# Altium schematic sheet CAN Expansion V1.SchDoc
size A4; SheetNumber: 1; SheetTotal: 1
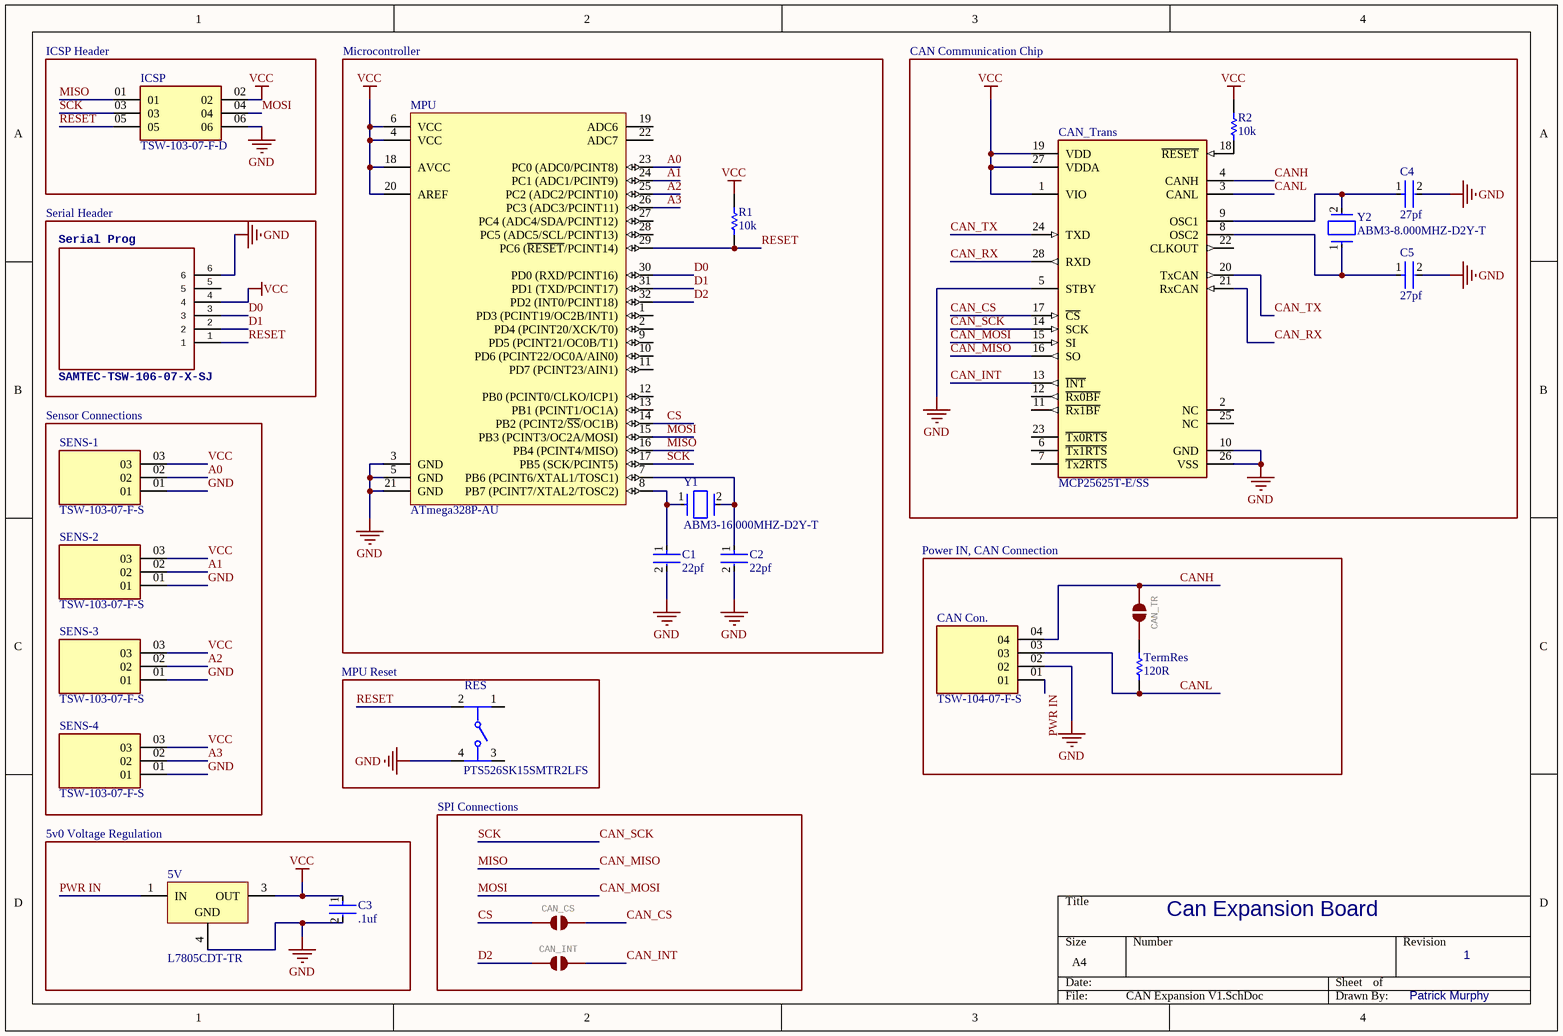
[diagram p0: CAN Expansion V1.SchDoc]

## Parts
5V  L7805CDT-TR  [TO-252_N]
C1  22pf  [FP-GRM21B-0_15-IPC_C]
C2  22pf  [FP-GRM21B-0_15-IPC_C]
C3  .1uf  [FP-GRM21B-0_15-IPC_C]
C4  27pf  [FP-GRM21B-0_15-IPC_C]
C5  27pf  [FP-GRM21B-0_15-IPC_C]
CAN_Con.  TSW-104-07-F-S  [SAMTEC_TSW-104-07-F-S]
CAN_CS  (no value)  [SMT-JUMPER_2_NO_SILK]
CAN_INT  (no value)  [SMT-JUMPER_2_NO_SILK]
CAN_TR  (no value)  [SMT-JUMPER_2_NO_SILK]
CAN_Trans  MCP25625T-E/SS  [FP-C04-073-IPC_B]
ICSP  TSW-103-07-F-D  [SAMTEC_TSW-103-07-F-D]
MPU  ATmega328P-AU  [32A_M]
R1  10k  [RESC2013X60X40LL20T25]
R2  10k  [RESC2013X60X40LL20T25]
RES  PTS526SK15SMTR2LFS  [FP-PTS526SK15SMTR2LFS-MFG]
SENS-1  TSW-103-07-F-S  [SAMTEC_TSW-103-07-F-S]
SENS-2  TSW-103-07-F-S  [SAMTEC_TSW-103-07-F-S]
SENS-3  TSW-103-07-F-S  [SAMTEC_TSW-103-07-F-S]
SENS-4  TSW-103-07-F-S  [SAMTEC_TSW-103-07-F-S]
Serial_Prog  SAMTEC-TSW-106-07-X-SJ  [SAMTEC-TSW-106-07-X-S]
TermRes  120R  [RESC2013X60X40LL20T25]
Y1  ABM3-16.000MHZ-D2Y-T  [FP-ABM3-MFG]
Y2  ABM3-8.000MHZ-D2Y-T  [FP-ABM3-MFG]

## Blocks framed on the sheet
ICSP Header: ICSP
Microcontroller: C1 C2 MPU R1 Y1
CAN Communication Chip: C4 C5 CAN_Trans R2 Y2
Serial Header: Serial_Prog
Sensor Connections: SENS-1-SENS-4
Power IN, CAN Connection: CAN_Con. CAN_TR TermRes
MPU Reset: RES
5v0 Voltage Regulation: 5V C3
SPI Connections: CAN_CS CAN_INT

## Nets
GND: 5V.4(GND) C1.2 C2.2 C3.2 C4.2 C5.2 CAN_Con..02 CAN_Trans.5(STBY) CAN_Trans.10(GND) CAN_Trans.26(VSS) ICSP.06 MPU.3(GND) MPU.5(GND) MPU.21(GND) RES.4 SENS-1.01 SENS-2.01 SENS-3.01 SENS-4.01 Serial_Prog.6
VCC: 5V.3(OUT) C3.1 CAN_Trans.1(VIO) CAN_Trans.19(VDD) CAN_Trans.27(VDDA) ICSP.02 MPU.4(VCC) MPU.6(VCC) MPU.18(AVCC) MPU.20(AREF) R1.2 R2.2 SENS-1.03 SENS-2.03 SENS-3.03 SENS-4.03 Serial_Prog.4
A0: MPU.23(PC0_(ADC0/PCINT8)) SENS-1.02
A1: MPU.24(PC1_(ADC1/PCINT9)) SENS-2.02
A2: MPU.25(PC2_(ADC2/PCINT10)) SENS-3.02
A3: MPU.26(PC3_(ADC3/PCINT11)) SENS-4.02
CAN_CS: CAN_CS.2 CAN_Trans.17(~{CS})
CAN_INT: CAN_INT.2 CAN_Trans.13(~{INT})
CAN_MISO: CAN_Trans.16(SO) ICSP.01 MPU.16(PB4_(PCINT4/MISO))  [also labelled MISO]
CAN_MOSI: CAN_Trans.15(SI) ICSP.04 MPU.15(PB3_(PCINT3/OC2A/MOSI))  [also labelled MOSI]
CAN_RX: CAN_Trans.21(RxCAN) CAN_Trans.28(RXD)
CAN_SCK: CAN_Trans.14(SCK) ICSP.03 MPU.17(PB5_(SCK/PCINT5))  [also labelled SCK]
CAN_TX: CAN_Trans.20(TxCAN) CAN_Trans.24(TXD)
CANH: CAN_Con..04 CAN_TR.1 CAN_Trans.4(CANH)
CANL: CAN_Con..03 CAN_Trans.3(CANL) TermRes.1
CS: CAN_CS.1 MPU.14(PB2_(PCINT2/~{SS}/OC1B))
D0: MPU.30(PD0_(RXD/PCINT16)) Serial_Prog.3
D1: MPU.31(PD1_(TXD/PCINT17)) Serial_Prog.2
D2: CAN_INT.1 MPU.32(PD2_(INT0/PCINT18))
PWR IN: 5V.1(IN) CAN_Con..01
RESET: ICSP.05 MPU.29(PC6_(~{RESET}/PCINT14)) R1.1 RES.2 Serial_Prog.1
NetC1_1: C1.1 MPU.8(PB7_(PCINT7/XTAL2/TOSC2)) Y1.1
NetC2_1: C2.1 MPU.7(PB6_(PCINT6/XTAL1/TOSC1)) Y1.2
NetC4_1: C4.1 CAN_Trans.9(OSC1) Y2.2
NetC5_1: C5.1 CAN_Trans.8(OSC2) Y2.1
NetCAN_TR_2: CAN_TR.2 TermRes.2
NetCAN_Trans_18: CAN_Trans.18(~{RESET}) R2.1

Not connected (* = marked no-connect by the designer): CAN_Trans 2(NC) 6(~{Tx1RTS}) 7(~{Tx2RTS}) 11(~{Rx1BF}) 12(~{Rx0BF}) 22(CLKOUT) 23(~{Tx0RTS}) 25(NC); MPU 1(PD3_(PCINT19/OC2B/INT1)) 2(PD4_(PCINT20/XCK/T0)) 9(PD5_(PCINT21/OC0B/T1)) 10(PD6_(PCINT22/OC0A/AIN0)) 11(PD7_(PCINT23/AIN1)) 12(PB0_(PCINT0/CLKO/ICP1)) 13(PB1_(PCINT1/OC1A)) 19(ADC6) 22(ADC7) 27(PC4_(ADC4/SDA/PCINT12)) 28(PC5_(ADC5/SCL/PCINT13)); RES 1 3; Serial_Prog 5

## Notes on the sheet
- Can Expansion Board
- 1
- Patrick Murphy

## Library data of the parts
5V = CMP-0244-00216-1: Positive Voltage Regulator, 3-Pin DPAK, Tape and Reel; PackageVersion: 2011; PackageReference: TO-252; DatasheetVersion: 16/11/2011; PackageDescription: 3-Pin Transistor Outline Package 2.28 mm Pitch, 9.7 mm Lead Span (DPAK); ComponentLink1URL: http://www.st.com; ComponentLink2Description: Datasheet; ComponentLink1Description: Manufacturer URL; ComponentLink2URL: http://www.st.com/internet/com/TECHNICAL_RESOURCES/TECHNICAL_LITERATURE/DATASHEET/CD00000444.pdf
C1-C5 = CMP-2007-03541-2: Chip Multilayer Ceramic Capacitors for General Purpose, 0805, 10uF, X5R, 15%, 10%, 25V; Length: 2mm; Depth: 1.25mm; Termination: SMD/SMT; Voltage: 25V; Height: 1.25mm; Material: Ceramic; Thickness: 0.053inch; Radiation Hardening: No; Min Operating Temperature: -55°C; Width: 0.049inch; Package Quantity: 1; Mount: Surface Mount; Dielectric: X5R; Packaging: Tape and Reel; Capacitance: 10uF; Voltage Rating (DC): 25V; Lead Free: Lead Free; Max Operating Temperature: 85°C; Case Code (Imperial): 0805; Case/Package: 0805; Tolerance: 10%; Voltage Rating: 25V; Case Code (Metric): 2012
CAN_Con. = TSW-104-07-F-S: MF: Samtec; MP: TSW-104-07-F-S; Price: None; Package: None; Availability: Unavailable; Value: *
CAN_CS CAN_INT CAN_TR = JUMPER-SMT_2_NO_SILK: GateName_1: G$1; SymbolName_1: SMT-JUMPER_2_NO; DeviceName: _SILK; LibraryName: SparkFun-Jumpers; DeviceSetName: JUMPER-SMT_2_NO; Package: SMT-JUMPER_2_NO_SILK
CAN_Trans = CMP-06279-000016-1: IC TRANSCEIVER 1/1 28SSOP; Max Supply Voltage: 5.5V; Number of Receivers: 1; Receiver Hysteresis: 200mV; Data Rate: 1Mbps; Min Supply Voltage: 4.5V; Propagation Delay: 125ns; Operating Supply Current: 70mA; Interface: SPI; Case/Package: SSOP; Max Operating Temperature: 125°C; Weight: 0.080001oz; Mount: Surface Mount; RoHS Compliant: Yes; Package Quantity: 2100; Packaging: Tape and Reel; Min Operating Temperature: -40°C; Number of Pins: 28; Number of Drivers: 1; Number of Transceivers: 1
ICSP = TSW-103-07-F-D: MF: Samtec; Package: None; Availability: Unavailable; Value: *; MP: TSW-103-07-F-D; Price: None
MPU = CMP-0095-00269-2: 8-bit AVR Microcontroller, 32KB Flash, 1KB EEPROM, 2KB SRAM, 32-pin TQFP, Industrial Grade (-40°C to 85°C); PackageDescription: 32-Lead, 7x7x1.0 mm Body, 0.8mm Lead Pitch, Thin Profile Plastic Quad Flat Package (TQFP); DatasheetVersion: revD, May-2011; RevisionNote: DatasheetVersion & PackageVersion updated. URLs added.; ComponentLink1URL: http://www.atmel.com/; ComponentLink2Description: ATmega48A/48PA/88A/88PA/168A/168PA/328/328P Datasheet; Code_JEDEC: MS-026-ABA; ComponentLink1Description: Manufacturer URL; PackageReference: 32A; ComponentLink3Description: ATmega48A/48PA/88A/88PA/168A/168PA/328/328P Summary; ComponentLink2URL: http://www.atmel.com/dyn/resources/prod_documents/doc8271.pdf; PackageVersion: revC, Oct-2010; ComponentLink3URL: http://www.atmel.com/dyn/resources/prod_documents/8271S.pdf
R1 R2 TermRes = CMP-2001-00645-1: Part Number: ERA6AEB473V; Manufacturer: Panasonic
RES = CMP-10040-000013-1: TACT 5.2 X 5.2, 1.5 MM H, 260GF,; Manufacturer: C&K; Operating Force: 250gf; Throw Configuration: SPST-NO; Contact Current Rating: 50mA; Standoff Height: 0mm; Contact Resistance: 100mΩ; Voltage Rating Dc: 12V; Electromechanical Life: 200000Cycles; Device Class L3: Tactile Switches; Device Class L2: Switches; Temperature: -20°C to +70°C; Temperature Range Low: -20°C; Package: PTS526SK15SMTR2LFS; Temperature Range High: +70°C; ComponentLink2Description: Datasheet; Device Class L1: Electromechanical; Height: 1.65mm; Digikey Description: TACT 5.2 X 5.2, 1.5 MM H, 260GF,; Category: Switch; RoHS: TRUE; Automotive: No; Lead Free: Yes; Manufacturer Part Number: PTS526SK15SMTR2LFS; Octopart: https://octopart.com/pts526+sk15+smtr2+lfs-c%26k+components-100617999; ComponentLink2URL: https://www.ckswitches.com/media/2780/pts526.pdf
SENS-1-SENS-4 = TSW-103-07-F-S: MF: Samtec; Package: None; Price: None; MP: TSW-103-07-F-S; Availability: Unavailable; Value: *
Y1 = CMP-27762-004490-1: Crystal 16MHz ±20ppm 18pF SMD-2 5mm x 3.2mm; Frequency Stability: 30ppm; Series Resistance: 40R; Tolerance: 20ppm; Frequency Tolerance: 20ppm; Load Capacitance: 18pF; Resistor Type: Ceramic; Termination: SMD/SMT; Width: 0.126inch; Mount: Surface Mount; RoHS Compliant: Yes; Package Quantity: 1000; Height: 0.051inch; Length: 0.197inch; Frequency: 16MHz; Operating Frequency: 16 MHz; Packaging: Tape and Reel; Max Operating Temperature: 85°C; Series: ABM3; Case/Package: SMD/SMT; Lead Free: Lead Free; ESR (Equivalent Series Resistance): 40R; Number of Pins: 2; Min Operating Temperature: -40°C
Y2 = CMP-2000-05033-2: Crystal 8MHz ±20ppm 18pF SMD-2 5mm x 3.2mm; Series Resistance: 500R; Frequency Stability: 30ppm; ESR (Equivalent Series Resistance): 140R; Load Capacitance: 18pF; Height: 0.051inch; Tolerance: 20ppm; Depth: 3.2mm; Max Operating Temperature: 85°C; Frequency: 8MHz; Termination: SMD/SMT; Lead Free: Lead Free; Number of Pins: 2; Width: 3.2mm; RoHS Compliant: Yes; Resistor Type: Ceramic; Length: 5mm; Mount: Surface Mount; Case/Package: CSMD; Package Quantity: 1000; Radiation Hardening: No; Min Operating Temperature: -40°C; Packaging: Tape and Reel; Frequency Tolerance: 20ppm